# Altium schematic sheet cpuboard.SchDoc
size A4; PageSetup: Record=PageOptions|CenterHorizontal=True|CenterVertical=True|PrintScale=1.00|XCorrection=1.00|YCorrection=1.00|PrintKind=0|BorderSize=5000000|LeftOffset=0|BottomOffset=0|Orientation=2|PaperLength=1000|PaperWidth=1000|Scale=100|PaperSource=7|PrintQuality=-3|MediaType=1|DitherType=10|PrintScaleMode=1|PaperKind=A4|PaperIndex=9
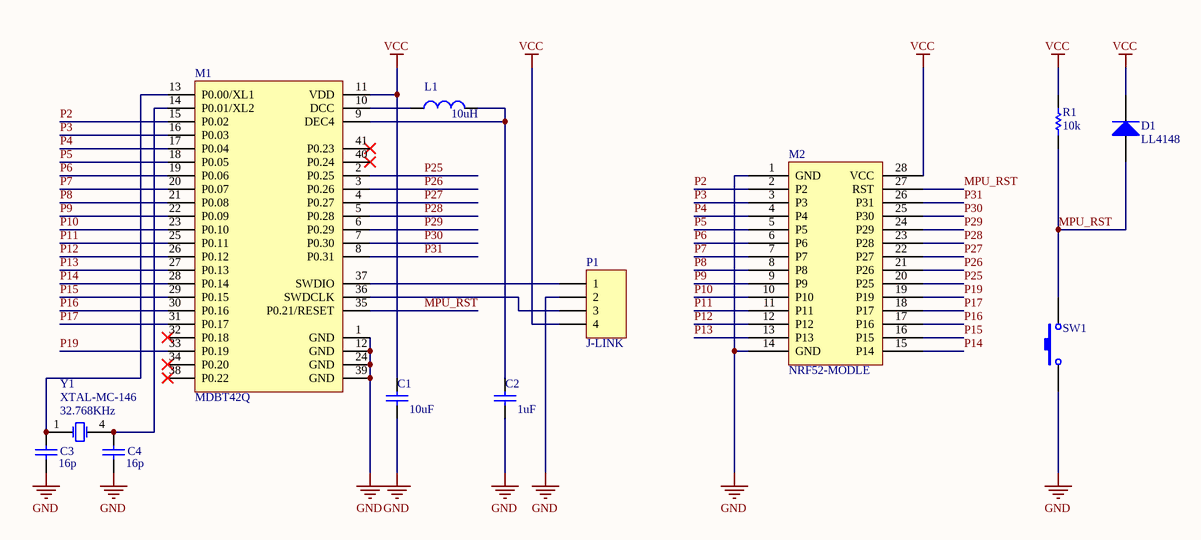
[diagram p0: cpuboard.SchDoc]

## Parts
C1  value 10uF  [1608[0603]]  (hidden comment: Cap1)
C2  value 1uF  [1608[0603]]  (hidden comment: Cap1)
C3  value 16p  [1608[0603]]  (hidden comment: Cap1)
C4  value 16p  [1608[0603]]  (hidden comment: Cap1)
D1  LL4148  [SOD80]
L1  value 10uH  [2012[0805]]  (hidden comment: Inductor)
M1  MDBT42Q  [MDBT42Q]
M2  NRF52-MODLE  [NRF52-MODLE]
P1  J-LINK  [HDR1X4]
R1  value 10k  [1608[0603]]  (hidden comment: Res)
SW1  TL3342F160QG  [TL3342F160QG]  (value not drawn)
Y1  XTAL-MC-146  value 32.768KHz  [MC-146]

## Nets
GND: C1.1 C2.1 C3.1 C4.1 M1.1(GND) M1.12(GND) M1.24(GND) M1.39(GND) M2.1(GND) M2.14(GND) P1.2 SW1.1
VCC: C1.2 D1.2(K) M1.11(VDD) M2.28(VCC) P1.4 R1.1
MPU_RST: D1.1(A) M1.35(P0.21/RESET) M2.27(RST) R1.2 SW1.3
P2: M1.15(P0.02) M2.2(P2)
P3: M1.16(P0.03) M2.3(P3)
P4: M1.17(P0.04) M2.4(P4)
P5: M1.18(P0.05) M2.5(P5)
P6: M1.19(P0.06) M2.6(P6)
P7: M1.20(P0.07) M2.7(P7)
P8: M1.21(P0.08) M2.8(P8)
P9: M1.22(P0.09) M2.9(P9)
P10: M1.23(P0.10) M2.10(P10)
P11: M1.25(P0.11) M2.11(P11)
P12: M1.26(P0.12) M2.12(P12)
P13: M1.27(P0.13) M2.13(P13)
P14: M1.28(P0.14) M2.15(P14)
P15: M1.29(P0.15) M2.16(P15)
P16: M1.30(P0.16) M2.17(P16)
P17: M1.31(P0.17) M2.18(P17)
P19: M1.33(P0.19) M2.19(P19)
P25: M1.2(P0.25) M2.20(P25)
P26: M1.3(P0.26) M2.21(P26)
P27: M1.4(P0.27) M2.22(P27)
P28: M1.5(P0.28) M2.23(P28)
P29: M1.6(P0.29) M2.24(P29)
P30: M1.7(P0.30) M2.25(P30)
P31: M1.8(P0.31) M2.26(P31)
NetC2_2: C2.2 L1.2 M1.9(DEC4)
NetC3_2: C3.2 M1.13(P0.00/XL1) Y1.1(OSC1)
NetC4_2: C4.2 M1.14(P0.01/XL2) Y1.4(OSC2)
NetL1_1: L1.1 M1.10(DCC)
NetM1_36: M1.36(SWDCLK) P1.3
NetM1_37: M1.37(SWDIO) P1.1

Not connected (* = marked no-connect by the designer): M1 32(P0.18)* 34(P0.20)* 38(P0.22)* 40(P0.24)* 41(P0.23)*

## Library data of the parts
P1 = Header 4: Header, 4-Pin; LatestRevisionDate: 17-Jul-2002; LatestRevisionNote: Re-released for DXP Platform.; Publisher: Altium Limited